# Altium schematic sheet TYPEC0.SchDoc
size A4; SheetNumber: 2; SheetTotal: 26
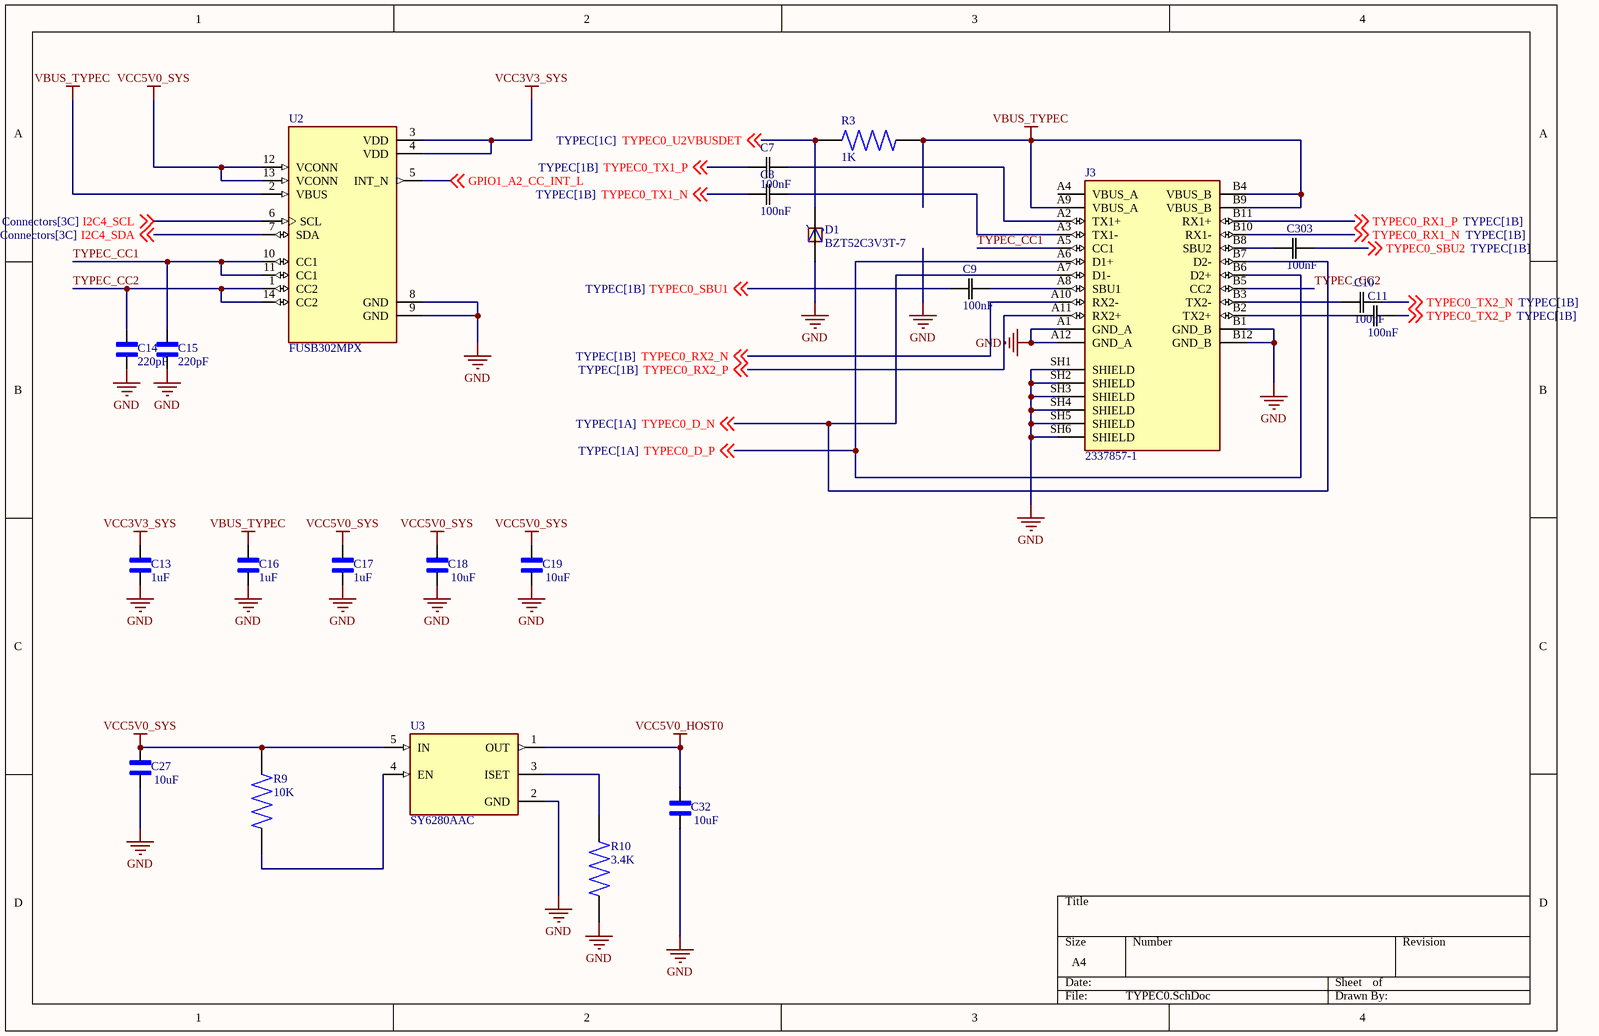
[diagram p0: TYPEC0.SchDoc]

## Parts
C7  100nF  [CAP_1005_TDK]
C8  100nF  [CAP_1005_TDK]
C9  100nF  [CAP_1005_TDK]
C10  100nF  [CAP_1005_TDK]
C11  100nF  [CAP_1005_TDK]
C13  1uF  [CAPC1005X56N]
C14  220pF  [CAPC1608X90]
C15  220pF  [CAPC1608X90]
C16  1uF  [CAPC1005X56N]
C17  1uF  [CAPC1005X56N]
C18  10uF  [CAPC1005X70N]
C19  10uF  [CAPC1005X70N]
C27  10uF  [CAPC1005X70N]
C32  10uF  [CAPC1005X70N]
C303  100nF  [CAP_1005_TDK]
D1  BZT52C3V3T-7  [SODFL1608X65N]
J3  2337857-1  [TE_2337857-1]
R3  1K  [RESC1608X55N]
R9  10K  [RES_ERA3ARB103V]
R10  3.4K  [RES_ERJPA2F3401X]
U2  FUSB302MPX  [QFN50P250X250X80-15N]
U3  SY6280AAC  [SOT95P285X130-5N]

## Nets
GND: C13.1 C14.2 C15.2 C16.1 C17.1 C18.1 C19.1 C27.1 C32.1 D1.A J3.A1(GND_A) J3.A12(GND_A) J3.B1(GND_B) J3.B12(GND_B) J3.SH1(SHIELD) J3.SH2(SHIELD) J3.SH3(SHIELD) J3.SH4(SHIELD) J3.SH5(SHIELD) J3.SH6(SHIELD) R10.1 U2.8(GND) U2.9(GND) U3.2(GND)
VBUS_TYPEC: C16.2 J3.A9(VBUS_A) J3.B4(VBUS_B) J3.B9(VBUS_B) R3.2 U2.2(VBUS)
VCC3V3_SYS: C13.2 U2.3(VDD) U2.4(VDD)
VCC5V0_HOST0: C32.2 U3.1(OUT)
VCC5V0_SYS: C17.2 C18.2 C19.2 C27.2 R9.2 U2.12(VCONN) U2.13(VCONN) U3.5(IN)
GPIO1_A2_CC_INT_L: U2.5(INT_N) ; off-sheet GPIO1_A2_CC_INT_L
I2C4_SCL: U2.6(SCL) ; off-sheet I2C4_SCL
I2C4_SDA: U2.7(SDA) ; off-sheet I2C4_SDA
TYPEC0_D_N: J3.A7(D1-) J3.B7(D2-) ; off-sheet TYPEC0_D_N
TYPEC0_D_P: J3.A6(D1+) J3.B6(D2+) ; off-sheet TYPEC0_D_P
TYPEC0_RX1_N: J3.B10(RX1-) ; off-sheet TYPEC0_RX1_N
TYPEC0_RX1_P: J3.B11(RX1+) ; off-sheet TYPEC0_RX1_P
TYPEC0_RX2_N: J3.A10(RX2-) ; off-sheet TYPEC0_RX2_N
TYPEC0_RX2_P: J3.A11(RX2+) ; off-sheet TYPEC0_RX2_P
TYPEC0_SBU1: C9.2 ; off-sheet TYPEC0_SBU1
TYPEC0_SBU2: C303.1 ; off-sheet TYPEC0_SBU2
TYPEC0_TX1_N: C8.2 ; off-sheet TYPEC0_TX1_N
TYPEC0_TX1_P: C7.2 ; off-sheet TYPEC0_TX1_P
TYPEC0_TX2_N: C10.1 ; off-sheet TYPEC0_TX2_N
TYPEC0_TX2_P: C11.1 ; off-sheet TYPEC0_TX2_P
TYPEC0_U2VBUSDET: D1.C R3.1 ; off-sheet TYPEC0_U2VBUSDET
TYPEC_CC1: C15.1 J3.A5(CC1) U2.10(CC1) U2.11(CC1)
TYPEC_CC2: C14.1 J3.B5(CC2) U2.1(CC2) U2.14(CC2)
NetC7_1: C7.1 J3.A2(TX1+)
NetC8_1: C8.1 J3.A3(TX1-)
NetC9_1: C9.1 J3.A8(SBU1)
NetC10_2: C10.2 J3.B3(TX2-)
NetC11_2: C11.2 J3.B2(TX2+)
NetC303_2: C303.2 J3.B8(SBU2)
NetR9_1: R9.1 U3.4(EN)
NetR10_2: R10.2 U3.3(ISET)

Not connected (* = marked no-connect by the designer): J3 A4(VBUS_A)

## Library data of the parts
C7-C11 C303 = C1005X7R1H104M050BB: Description; Manufacturer_Name: TDK; Copyright: Copyright (C) 2025 Ultra Librarian. All rights reserved.; Manufacturer_Part_Number: C1005X7R1H104M050BB
C13 C16 C17 = 0402ZD105KAT4A: 1 ÂµF Â±10% 10V Ceramic Capacitor X5R 0402 (1005 Metric); MF: AVX; SnapEDA_Link: https://www.snapeda.com/parts/0402ZD105KAT4A/AVX/view-part/?ref=snap; Package: 1005 AVX; Value: *; MP: 0402ZD105KAT4A; Check_prices: https://www.snapeda.com/parts/0402ZD105KAT4A/AVX/view-part/?ref=eda
C14 C15 = CC0603KRX7R7BB221: 220 pF Â±10% 16V Ceramic Capacitor X7R 0603 (1608 Metric); MF: Yageo; SnapEDA_Link: https://www.snapeda.com/parts/CC0603KRX7R7BB221/Yageo/view-part/?ref=snap; Package: 0603 Yageo; Value: *; MP: CC0603KRX7R7BB221; Check_prices: https://www.snapeda.com/parts/CC0603KRX7R7BB221/Yageo/view-part/?ref=eda
C18 C19 C27 C32 = CL05A106MQ5NUNC: 10 ÂµF Â±20% 6.3V Ceramic Capacitor X5R 0402 (1005 Metric); MF: Samsung; SnapEDA_Link: https://www.snapeda.com/parts/CL05A106MQ5NUNC/Samsung/view-part/?ref=snap; Package: SMD-2 Samsung; Value: *; MP: CL05A106MQ5NUNC; Check_prices: https://www.snapeda.com/parts/CL05A106MQ5NUNC/Samsung/view-part/?ref=eda
D1 = BZT52C3V3T-7: 3.3V 6% 300mW Zener Diode SOD-523 | Diodes Inc BZT52C3V3T-7; MF: Diodes Inc.; SnapEDA_Link: https://www.snapeda.com/parts/BZT52C3V3T-7/Diodes+Inc./view-part/?ref=snap; Package: SOD-523 Diodes Inc.; Value: *; MP: BZT52C3V3T-7; Check_prices: https://www.snapeda.com/parts/BZT52C3V3T-7/Diodes+Inc./view-part/?ref=eda
J3 = 2337857-1: VERTICAL USB TYPE-C REC; MF: TE Connectivity; SnapEDA_Link: https://www.snapeda.com/parts/2337857-1/TE+Connectivity/view-part/?ref=snap; Package: None; Value: *; MP: 2337857-1; Check_prices: https://www.snapeda.com/parts/2337857-1/TE+Connectivity/view-part/?ref=eda
R3 = CRCW06031K00FKECC: 1 kOhms Â±1% 0.1W, 1/10W Chip Resistor 0603 (1608 Metric) - Thick Film; MF: Vishay; SnapEDA_Link: https://www.snapeda.com/parts/CRCW06031K00FKECC/Vishay/view-part/?ref=snap; Package: 0603-2 Vishay; Value: *; MP: CRCW06031K00FKECC; Check_prices: https://www.snapeda.com/parts/CRCW06031K00FKECC/Vishay/view-part/?ref=eda
R9 = ERA3ARB103V: MP: ERA3ARB103V; Availability: Unavailable; Package: None; Value: *; Price: None
R10 = ERJPA2F3401X: Package: None; Price: None; Value: *; MP: ERJPA2F3401X; Availability: Unavailable
U2 = FUSB302MPX: USB Controller USB 3.1 USB Interface 14-MLP (2.5x2.5); MF: ON Semiconductor; SnapEDA_Link: https://www.snapeda.com/parts/FUSB302MPX/Onsemi/view-part/?ref=snap; Package: WFQFN-14 ON Semiconductor; Value: *; MP: FUSB302MPX; Check_prices: https://www.snapeda.com/parts/FUSB302MPX/Onsemi/view-part/?ref=eda
U3 = SY6280AAC: USB Power Distribution SW Single 5.5V 1A 5-Pin SOT-23; MF: Silergy; SnapEDA_Link: https://www.snapeda.com/parts/SY6280AAC/Silergy/view-part/?ref=snap; Package: SOT-23-5 Silergy; Value: *; MP: SY6280AAC; Check_prices: https://www.snapeda.com/parts/SY6280AAC/Silergy/view-part/?ref=eda